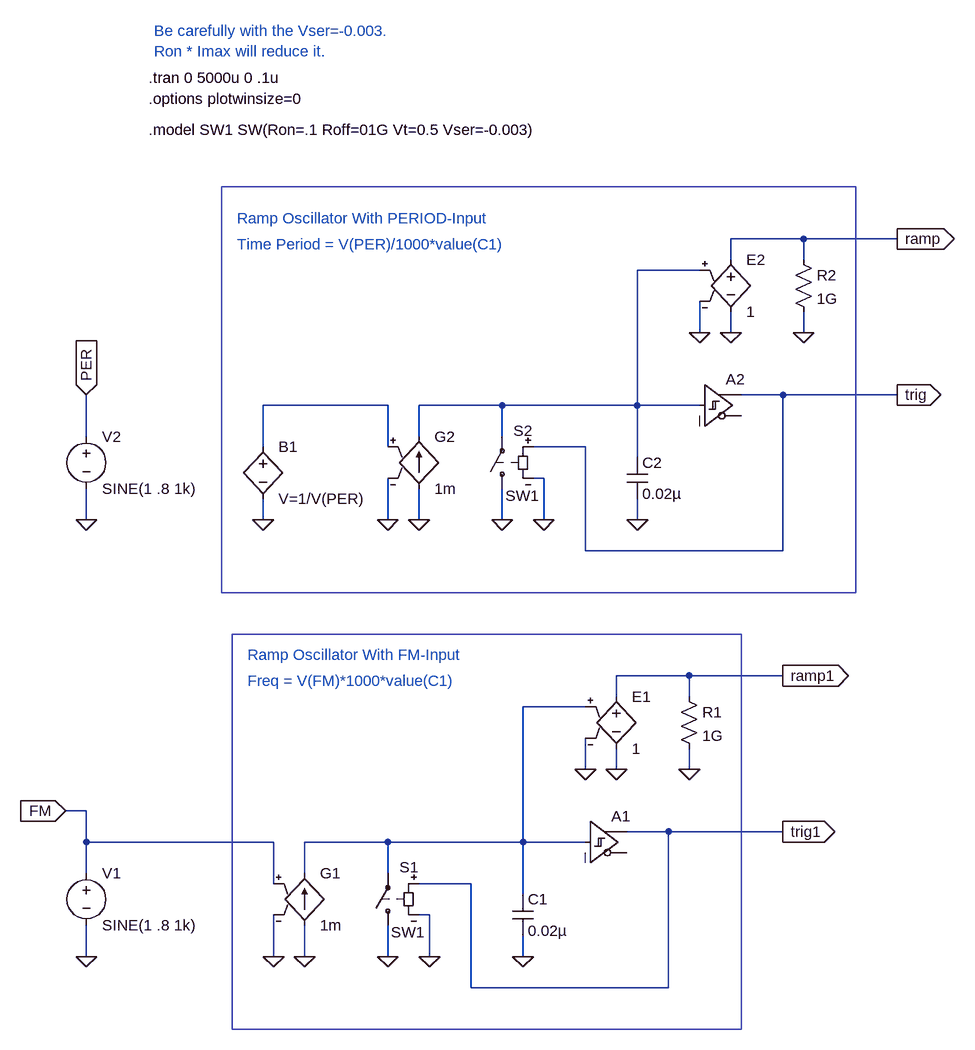
[diagram p0: schematic modulated_sawtooth3.asc]
modulated_sawtooth3.asc, the LTspice schematic file:
Version 4
SHEET 1 1640 1188
WIRE -1040 272 -1040 208
WIRE -1040 400 -1040 352
WIRE -1040 848 -1072 848
WIRE -1040 896 -1040 848
WIRE -1040 944 -1040 896
WIRE -1040 1072 -1040 1024
WIRE -768 288 -768 224
WIRE -768 400 -768 368
WIRE -752 896 -1040 896
WIRE -752 960 -752 896
WIRE -752 1072 -752 1008
WIRE -704 944 -704 896
WIRE -704 1072 -704 1024
WIRE -576 224 -768 224
WIRE -576 288 -576 224
WIRE -576 400 -576 336
WIRE -576 896 -704 896
WIRE -576 944 -576 896
WIRE -576 1072 -576 1024
WIRE -528 272 -528 224
WIRE -528 400 -528 352
WIRE -512 1008 -528 1008
WIRE -512 1072 -512 1008
WIRE -448 960 -528 960
WIRE -448 1120 -448 960
WIRE -400 224 -528 224
WIRE -400 272 -400 224
WIRE -400 400 -400 352
WIRE -368 896 -576 896
WIRE -368 896 -368 688
WIRE -368 976 -368 896
WIRE -368 1072 -368 1040
WIRE -336 336 -352 336
WIRE -336 400 -336 336
WIRE -272 288 -352 288
WIRE -272 448 -272 288
WIRE -272 688 -368 688
WIRE -272 784 -272 736
WIRE -272 896 -368 896
WIRE -224 672 -224 640
WIRE -224 784 -224 752
WIRE -192 224 -400 224
WIRE -192 224 -192 16
WIRE -192 304 -192 224
WIRE -192 400 -192 368
WIRE -144 880 -208 880
WIRE -144 1120 -448 1120
WIRE -144 1120 -144 880
WIRE -112 640 -224 640
WIRE -112 672 -112 640
WIRE -112 784 -112 752
WIRE -96 16 -192 16
WIRE -96 112 -96 64
WIRE -96 224 -192 224
WIRE -48 0 -48 -32
WIRE -48 112 -48 80
WIRE 32 208 -32 208
WIRE 32 448 -272 448
WIRE 32 448 32 208
WIRE 32 640 -112 640
WIRE 32 880 -144 880
WIRE 64 -32 -48 -32
WIRE 64 0 64 -32
WIRE 64 112 64 80
WIRE 208 -32 64 -32
WIRE 208 208 32 208
FLAG -368 1072 0
FLAG -704 1072 0
FLAG -752 1072 0
FLAG -1040 1072 0
FLAG -512 1072 0
FLAG -576 1072 0
FLAG 32 880 trig1
IOPIN 32 880 Out
FLAG -272 784 0
FLAG -224 784 0
FLAG 32 640 ramp1
IOPIN 32 640 Out
FLAG -1072 848 FM
IOPIN -1072 848 In
FLAG -112 784 0
FLAG -768 400 0
FLAG -192 400 0
FLAG -528 400 0
FLAG -576 400 0
FLAG -336 400 0
FLAG -400 400 0
FLAG 208 208 trig
IOPIN 208 208 Out
FLAG -96 112 0
FLAG -48 112 0
FLAG 208 -32 ramp
IOPIN 208 -32 Out
FLAG 64 112 0
FLAG -1040 400 0
FLAG -1040 208 PER
IOPIN -1040 208 In
SYMBOL Digital\\schmitt -272 832 R0
SYMATTR InstName A1
SYMATTR Value2 vt=0.5 vh=0.5
SYMATTR SpiceLine td=5n
SYMBOL cap -384 976 R0
SYMATTR InstName C1
SYMATTR Value 0.02µ
SYMBOL g -704 928 R0
SYMATTR InstName G1
SYMATTR Value 1m
SYMBOL voltage -1040 928 R0
WINDOW 123 0 0 Left 0
WINDOW 39 0 0 Left 0
SYMATTR InstName V1
SYMATTR Value SINE(1 .8 1k)
SYMBOL sw -576 1040 R180
WINDOW 0 -47 105 Left 0
WINDOW 3 -57 5 Left 0
SYMATTR InstName S1
SYMATTR Value SW1
SYMBOL e -224 656 R0
SYMATTR InstName E1
SYMATTR Value 1
SYMBOL res -128 656 R0
SYMATTR InstName R1
SYMATTR Value 1G
SYMBOL bv -768 272 R0
SYMATTR InstName B1
SYMATTR Value V=1/V(PER)
SYMBOL Digital\\schmitt -96 160 R0
SYMATTR InstName A2
SYMATTR Value2 vt=0.5 vh=0.5
SYMATTR SpiceLine td=5n
SYMBOL cap -208 304 R0
SYMATTR InstName C2
SYMATTR Value 0.02µ
SYMBOL g -528 256 R0
SYMATTR InstName G2
SYMATTR Value 1m
SYMBOL sw -400 368 R180
WINDOW 0 -47 105 Left 0
WINDOW 3 -57 5 Left 0
SYMATTR InstName S2
SYMATTR Value SW1
SYMBOL e -48 -16 R0
SYMATTR InstName E2
SYMATTR Value 1
SYMBOL res 48 -16 R0
SYMATTR InstName R2
SYMATTR Value 1G
SYMBOL voltage -1040 256 R0
WINDOW 123 0 0 Left 0
WINDOW 39 0 0 Left 0
SYMATTR InstName V2
SYMATTR Value SINE(1 .8 1k)
TEXT -944 -280 Left 0 !.tran 0 5000u 0 .1u
TEXT -944 -248 Left 0 !.options plotwinsize=0
TEXT -792 608 Left 0 ;Ramp Oscillator With FM-Input
TEXT -792 648 Left 0 ;Freq = V(FM)*1000*value(C1)
TEXT -944 -200 Left 0 !.model SW1 SW(Ron=.1 Roff=01G Vt=0.5 Vser=-0.003)
TEXT -808 -64 Left 0 ;Ramp Oscillator With PERIOD-Input
TEXT -808 -24 Left 0 ;Time Period = V(PER)/1000*value(C1)
TEXT -936 -352 Left 0 ;Be carefully with the Vser=-0.003.\nRon * Imax will reduce it.
RECTANGLE Normal -32 1184 -816 576
RECTANGLE Normal 144 512 -832 -112

The netlist it stands for:
* modulated_sawtooth3.asc
A1 N002 0 0 0 0 0 trig1 0 SCHMITT vt=0.5 vh=0.5 td=5n
C1 N002 0 0.02µ
G1 0 N002 FM 0 1m
V1 FM 0 SINE(1 .8 1k)
S1 0 N002 trig1 0 SW1
E1 ramp1 0 N002 0 1
R1 ramp1 0 1G
B1 N001 0 V=1/V(PER)
A2 N003 0 0 0 0 0 trig 0 SCHMITT vt=0.5 vh=0.5 td=5n
C2 N003 0 0.02µ
G2 0 N003 N001 0 1m
S2 0 N003 trig 0 SW1
E2 ramp 0 N003 0 1
R2 ramp 0 1G
V2 PER 0 SINE(1 .8 1k)
.tran 0 5000u 0 .1u
.options plotwinsize=0
* Ramp Oscillator With FM-Input
* Freq = V(FM)*1000*value(C1)
.model SW1 SW(Ron=.1 Roff=01G Vt=0.5 Vser=-0.003)
* Ramp Oscillator With PERIOD-Input
* Time Period = V(PER)/1000*value(C1)
* Be carefully with the Vser=-0.003.
* Ron * Imax will reduce it.
.backanno
.end